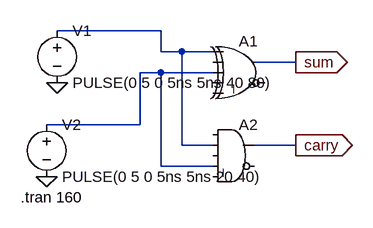
[diagram p0: schematic Half Adder Ltspice.asc]
Half Adder Ltspice.asc, the LTspice schematic file:
Version 4.1
SHEET 1 880 680
WIRE 288 96 128 96
WIRE 288 128 288 96
WIRE 320 128 288 128
WIRE 368 128 320 128
WIRE 496 144 432 144
WIRE 288 160 256 160
WIRE 368 160 288 160
WIRE 256 240 256 160
WIRE 256 240 112 240
WIRE 320 272 320 128
WIRE 368 272 320 272
WIRE 496 272 432 272
WIRE 288 304 288 160
WIRE 368 304 288 304
FLAG 128 176 0
FLAG 112 320 0
FLAG 496 144 sum
IOPIN 496 144 Out
FLAG 496 272 carry
IOPIN 496 272 Out
SYMBOL voltage 128 80 R0
WINDOW 123 0 0 Left 0
WINDOW 39 0 0 Left 0
SYMATTR InstName V1
SYMATTR Value PULSE(0 5 0 5ns 5ns 40 80)
SYMBOL voltage 112 224 R0
WINDOW 123 0 0 Left 0
WINDOW 39 0 0 Left 0
SYMATTR InstName V2
SYMATTR Value PULSE(0 5 0 5ns 5ns 20 40)
SYMBOL Digital\\xor 416 96 R0
SYMATTR InstName A1
SYMBOL Digital\\and 400 224 R0
SYMATTR InstName A2
TEXT 72 352 Left 2 !.tran 160

The netlist it stands for:
* Half Adder Ltspice.asc
V1 N001 0 PULSE(0 5 0 5ns 5ns 40 80)
V2 N002 0 PULSE(0 5 0 5ns 5ns 20 40)
A1 N001 0 N002 0 0 0 sum 0 XOR
A2 0 N001 0 N002 0 0 carry 0 AND
.tran 160
.backanno
.end